# Altium schematic sheet 37V_efuse.SchDoc
size A4
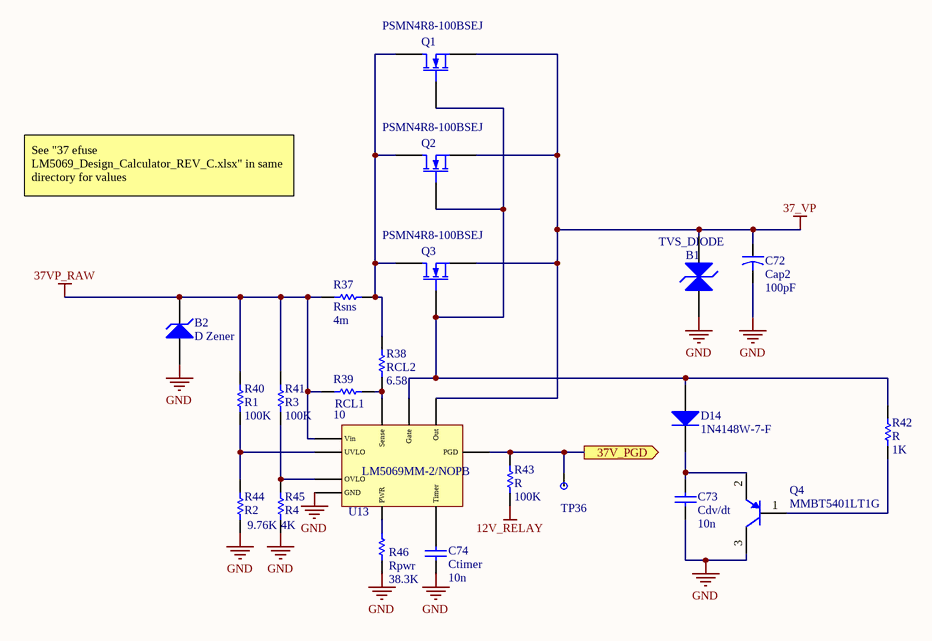
[diagram p0: 37V_efuse.SchDoc]

## Parts
B1  TVS_DIODE  [SMBJ54A-13-F]
B2  D Zener  [DIODE-0.7]
C72  Cap2  value 100pF  [CAPR5-4X5]
C73  Cdv/dt  value 10n  [RAD-0.3]
C74  Ctimer  value 10n  [RAD-0.3]
D14  1N4148W-7-F  [DIOD-SOD123-2_V]
Q1  PSMN4R8-100BSEJ  [DPAK254P1420X457-3N]
Q2  PSMN4R8-100BSEJ  [DPAK254P1420X457-3N]
Q3  PSMN4R8-100BSEJ  [DPAK254P1420X457-3N]
Q4  MMBT5401LT1G  [ONSC-SOT-23-3-318-08_V]
R37  Rsns  value 4m  [RESC1608X06N_0603]
R38  RCL2  value 6.58  [RESC1608X06N_0603]
R39  RCL1  value 10  [RESC1608X06N_0603]
R40  R1  value 100K  [RESC1608X06N_0603]
R41  R3  value 100K  [RESC1608X06N_0603]
R42  R  value 1K  [RESC1608X06N_0603]
R43  R  value 100K  [RESC1608X06N_0603]
R44  R2  value 9.76K  [RESC1608X06N_0603]
R45  R4  value 4K  [RESC1608X06N_0603]
R46  Rpwr  value 38.3K  [RESC1608X06N_0603]
TP36  TestPt  [50_MIL_PAD]  (value not drawn)
U13  LM5069MM-2/NOPB  [TSSOP50P490X110-10N]

## Ports
37V_PGD (out)

## Nets
12V_RELAY: R43.1
37_VP: B1.2(K) C72.1 Q1.3(S) Q2.3(S) Q3.3(S) U13.9(Out)
37VP_RAW: B2.2(K) R37.1 R39.1 R40.2 R41.2 U13.2(Vin)
GND: B1.1(A) B2.1(A) C72.2 C73.2 C74.1 Q4.3(C) R44.1 R45.1 R46.1 U13.5(GND)
37V_PGD: R43.2 TP36.1 U13.8(PGD) ; port 37V_PGD
NetC73_1: C73.1 D14.2(K) Q4.2(E)
NetC74_2: C74.2 U13.6(Timer)
NetD14_1: D14.1(A) Q1.1(G) Q2.1(G) Q3.1(G) R42.2 U13.10(Gate)
NetQ1_2: Q1.2(D) Q2.2(D) Q3.2(D) R37.2 R38.2
NetQ4_1: Q4.1(B) R42.1
NetR38_1: R38.1 R39.2 U13.1(Sense)
NetR40_1: R40.1 R44.2 U13.3(UVLO)
NetR41_1: R41.1 R45.2 U13.4(OVLO)
NetR46_2: R46.2 U13.7(PWR)

## Notes on the sheet
- See "37 efuse LM5069_Design_Calculator_REV_C.xlsx" in same directory for values

## Library data of the parts
B1 = TVS_DIODE: TVS Diode; Published: 8-Jun-2000; LatestRevisionDate: 17-Jul-2002; LatestRevisionNote: Re-released for DXP Platform.; PackageVersion: Sep-1996; PackageReference: SMC; Publisher: Altium Limited; PackageDescription: DO-214-AB/SMC; 2 C-Bend Leads; Body 7.9 x 5.9 mm, inc. leads (LxW); Code_JEDEC: DO-214-AB
B2 = D Zener: Zener Diode; Published: 8-Jun-2000; LatestRevisionDate: 17-Jul-2002; LatestRevisionNote: Re-released for DXP Platform.; PackageReference: DIODE-0.7; Publisher: Altium Limited; PackageDescription: Diode, Thru-Hole; 2 Leads; 0.7 in Pin Spacing
C72 = Cap2: Capacitor; Published: 23-Sep-2002; PackageReference: CAPR5-4X5; Publisher: Altium Limited; PackageDescription: Capacitor; 2 Leads
C73 C74 = Cap: Capacitor; Published: 8-Jun-2000; LatestRevisionDate: 17-Jul-2002; LatestRevisionNote: Re-released for DXP Platform.; PackageReference: RAD-0.3; Publisher: Altium Limited; PackageDescription: Radial Cap, Thru-Hole; 2 Leads; 0.3 in Pin Spacing
D14 = CMP-2000-04932-2: Fast Switching Diode, 100 V, 0.15 A, -65 to 150 degC, 2-Pin?SOD123, RoHS, Tape and Reel; Recovery Time: 4ns; Brand: DiodesIncorporated; Unit Weight: 0.000353oz; Max Surge Current: 2A; Peak Reverse Voltage: 100V; Ir - Reverse Current: 1uA; Vf - Forward Voltage: 1.25V; Configuration: Single; If - Forward Current: 0.15A; Product Category: Diodes-GeneralPurpose,Power,Switching; Operating Temperature Range: -65Cto+150C; Packaging: Reel; Manufacturer URL: http://www.diodes.com/; Maximum Operating Temperature: +150C; Height: 1.25mm; Minimum Operating Temperature: -65C; Product: SwitchingDiodes; Package URL: http://www.diodes.com/datasheets/ds18004.pdf; Type: SwitchingDiode; Package Reference: SOD123-2; Width: 1.7mm; Datasheet URL: http://www.farnell.com/datasheets/1915529.pdf; Datasheet Version: Rev. 24-2, 10/2013; Series: 1N4148; Factory Pack Quantity: 3000; Length: 2.85mm; RoHS: True; Manufacturer: DiodesIncorporated; Mounting Style: SMD/SMT; Package / Case: SOD-123
Q1-Q3 = PSMN4R8-100BSEJ: N-Channel MOSFET; Published: 8-Jun-2000; LatestRevisionDate: 17-Jul-2002; LatestRevisionNote: Re-released for DXP Platform.; PackageVersion: 1995/1996; PackageReference: E3; Publisher: Altium Limited; PackageDescription: TO, Flat Index; 3 In-Line, Axial Leads; Body Dia. 4.6mm; Lead Dia. 0.5 mm (max); Supplier 1: Digi-Key; Supplier Part Number 1: 1727-1103-1-ND
Q4 = CMP-1048-00557-1: High Voltage Transistor, PNP Silicon, 3-Pin SOT-23, Pb-Free, Tape and Reel; Manufacturer: On Semiconductor; fT Min (MHz): 100; IC Continuous (A): -0.5; Packing: Tape and Reel; PackageDescription: 3-Pin Small Outline Transistor, Body 2.92 x 1.3 mm, Pitch 0.95 mm; PartNumber: MMBT5401LT1G; DatasheetVersion: Rev. 11; PackageReference: SOT-23-3-318-08; Polarity: PNP; ComponentLink1URL: http://www.onsemi.com/; ComponentLink3URL: http://www.onsemi.cn/pub_link/Collateral/318-08.PDF; ComponentLink3Description: Package Specification; ComponentLink1Description: Manufacturer URL; Mounting Technology: Surface Mount; ComponentLink2URL: http://www.onsemi.cn/pub_link/Collateral/MMBT5401LT1-D.PDF; RoHS: TRUE; ComponentLink2Description: Datasheet; PackageVersion: Rev. AP, 11/2009
R37-R46 = Res1: Resistor; Published: 8-Jun-2000; LatestRevisionDate: 17-Jul-2002; LatestRevisionNote: Re-released for DXP Platform.; PackageReference: AXIAL-0.3; Publisher: Altium Limited; PackageDescription: Axial Device, Thru-Hole; 2 Leads; 0.3 in Pin Spacing
U13 = LM5069MM-2/NOPB: Hot Swap Controller 1-CH 80V N-Channel Positive High Voltage 10-Pin VSSOP T/R; Manufacturer 1: TI National Semiconductor; Min Supply Voltage: 9V; Number of Channels: 1; Output Voltage: 12V; Supplier 1: Digi-Key; Manufacturer Part Number 1: LM5069MM-2/NOPB; Stock 1: 115715; Pricing 1: 1=3.00000, 10=2.69700, 25=2.54920, 100=2.09610, 250=1.88080, 500=1.81280 (USD); RoHS: Yes; Mount: Surface Mount; Case/Package: MSOP; Number of Pins: 10; Min Operating Temperature: -40°C; Max Operating Temperature: 125°C; Packaging: Tape and Reel; Package Quantity: 1000; Max Supply Voltage: 80V; Number of Outputs: 1; Length: 3mm; Height: 0.86mm; Depth: 3.1mm; Width: 3mm; Radiation Hardening: No; Lead Free: Lead Free; REACH SVHC: No SVHC; ComponentLink1URL: https://datasheet.ciiva.com/15099/getdatasheetpartid-628880-15099677.pdf?src-supplier=Verical; ComponentLink1Description: https://datasheet.ciiva.com/15099/getdatasheetpartid-628880-15099677.pdf?src-supplier=Verical; ComponentLink2URL: https://datasheet.ciiva.com/3222/lm5069-3222438.pdf?src-supplier=Avnet; ComponentLink2Description: https://datasheet.ciiva.com/3222/lm5069-3222438.pdf?src-supplier=Avnet; ComponentLink3URL: https://datasheet.ciiva.com/3222/lm5069-3222470.pdf?src-supplier=Avnet; ComponentLink3Description: https://datasheet.ciiva.com/3222/lm5069-3222470.pdf?src-supplier=Avnet; ComponentLink4URL: https://datasheet.ciiva.com/6609/lm5069-6609670.pdf?src-supplier=Digi-Key; ComponentLink4Description: https://datasheet.ciiva.com/6609/lm5069-6609670.pdf?src-supplier=Digi-Key; ComponentLink5URL: https://datasheet.ciiva.com/1511/1642228-1511437.pdf?src-supplier=Element14; ComponentLink5Description: https://datasheet.ciiva.com/1511/1642228-1511437.pdf?src-supplier=Element14; Supplier Part Number 1: LM5069MM-2/NOPBCT-ND